# EAGLE design pad2 (EAGLE 6.5.0)
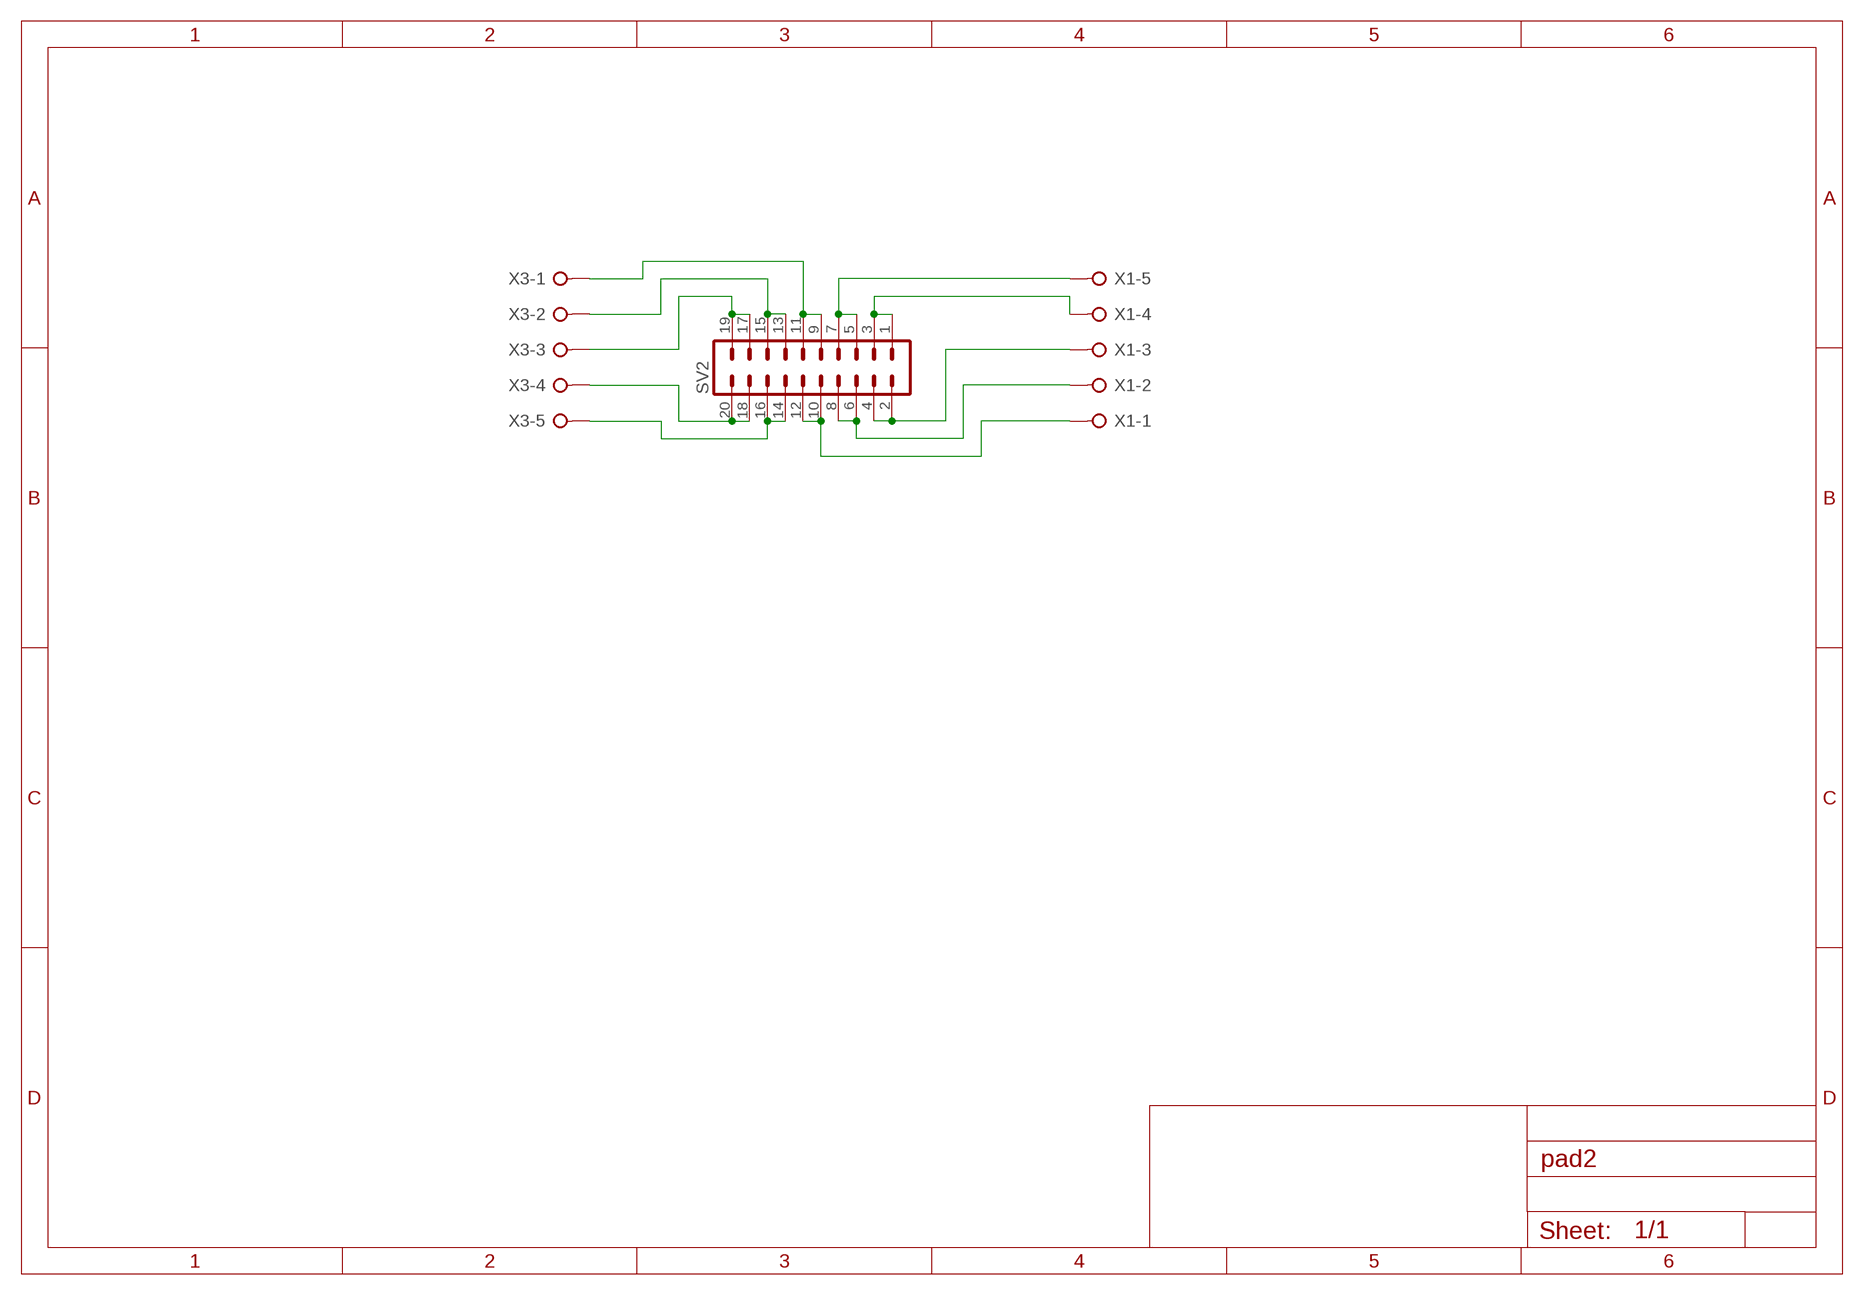
[diagram p0: schematic, sheet 1]

## Parts
SV2  MA10-2  [MA10-2]
X1  W237-05P  [W237-5P]
X3  W237-05P  [W237-5P]

## Nets
IN1: SV2.13 SV2.15 X3.2
IN2: SV2.17 SV2.19 X3.3
IN3: SV2.18 SV2.20 X3.4
IN4: SV2.14 SV2.16 X3.5
N$1: SV2.9 SV2.11 X3.1
N$2: SV2.10 SV2.12 X1.1
OUT1: SV2.6 SV2.8 X1.2
OUT2: SV2.2 SV2.4 X1.3
OUT3: SV2.1 SV2.3 X1.4
OUT4: SV2.5 SV2.7 X1.5

## Library data of the parts
SV2 = con-lstb:MA10-2: PIN HEADER; OC_FARNELL: unknown; OC_NEWARK: unknown
X1 X3 = con-wago-508:W237-05P: WAGO SREW CLAMP; OC_FARNELL: unknown; OC_NEWARK: unknown

## Board
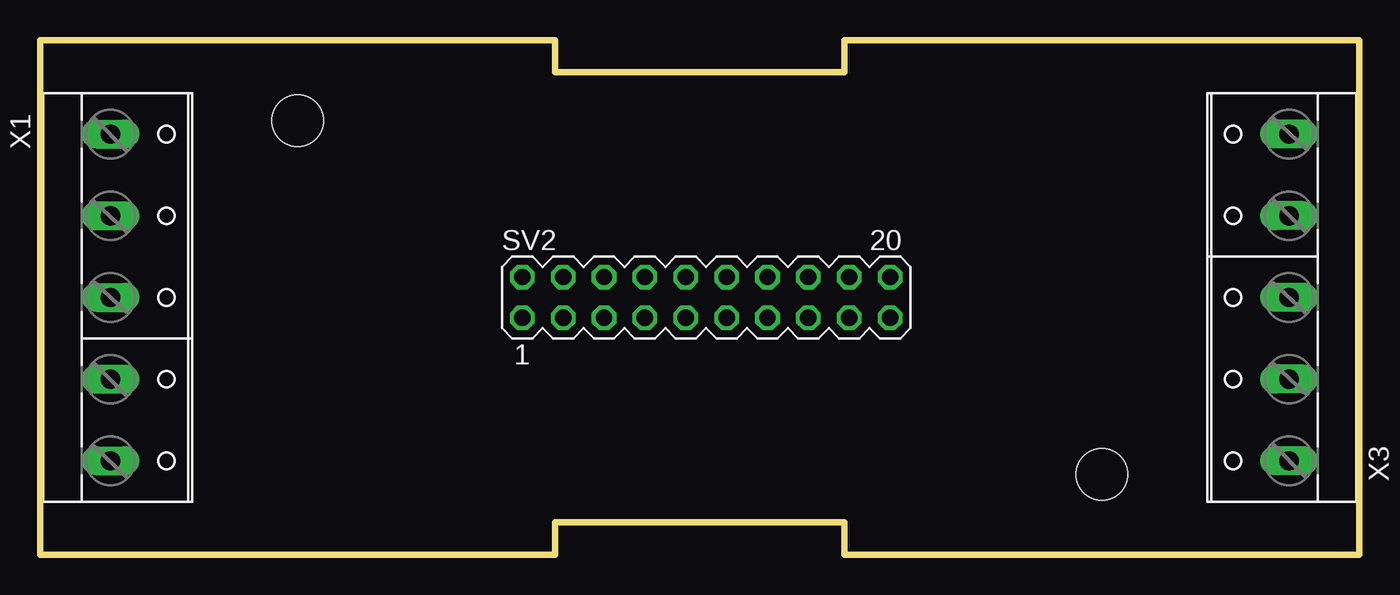
[diagram p1: board, top side]
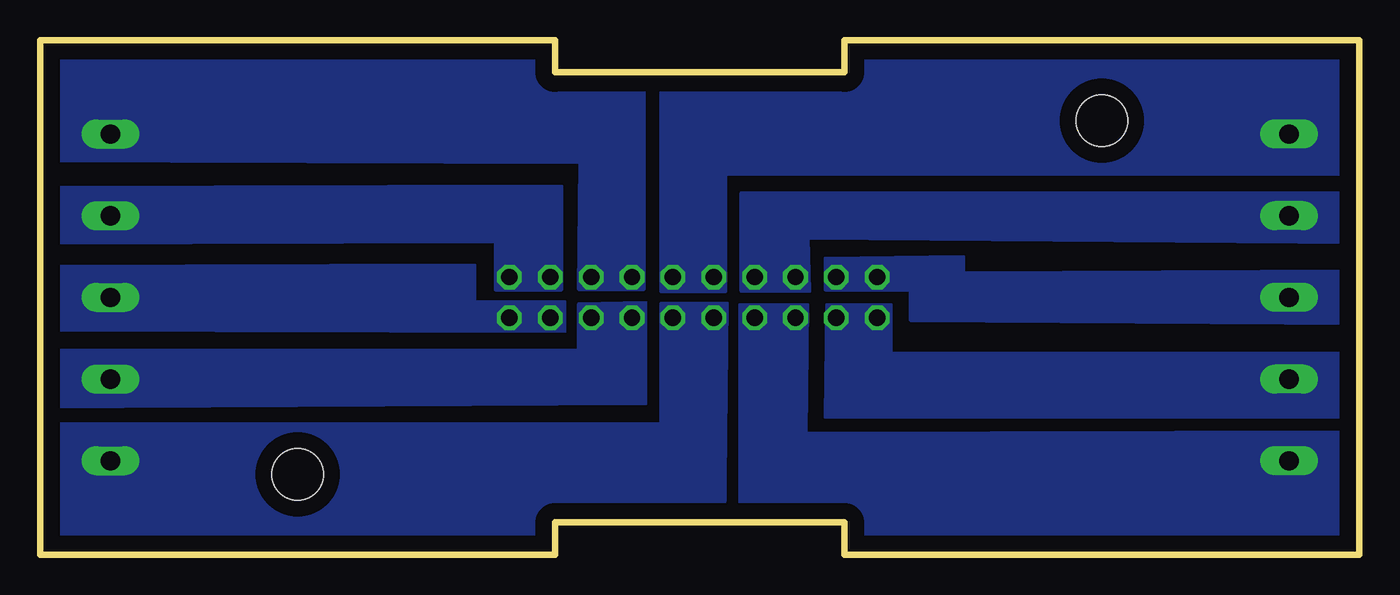
[diagram p2: board, bottom side, seen from below]

Size 82 x 32 mm. Coordinates in mm from the lower left corner, seen from the top.
Outline: 0,32 32,32 32,30 50,30 50,32 82,32 82,0 50,0 50,2 32,2 32,0 0,0 0,32
Copper layers (1*16): Top 0.035mm / dielectric 1.5mm / Bottom 0.035mm
Design rules "default": minimum track width 10mil, minimum drill 24mil, track to track 8mil, track to pad 8mil, pad to pad 8mil, via to via 8mil, smd to smd 8mil, copper to edge 40mil, drill to drill 8mil, minimum pad ring 10mil, minimum via ring 8mil, stop-mask expansion 4mil, vias tented up to drill 0mil, thermal gap 10mil
Holes 3.2 mm at 16,27 66,5

### Footprints (pad centres in the part's own frame; a part is rotated, then mirrored left to right if it is on the bottom)
MA10-2 = drill 1.016 octagon: 1 -11.43,-1.27; 2 -11.43,1.27; 3 -8.89,-1.27; 4 -8.89,1.27; 5 -6.35,-1.27; 6 -6.35,1.27; 7 -3.81,-1.27; 8 -3.81,1.27; 9 -1.27,-1.27; 10 -1.27,1.27; 11 1.27,-1.27; 12 1.27,1.27; 13 3.81,-1.27; 14 3.81,1.27; 15 6.35,-1.27; 16 6.35,1.27; 17 8.89,-1.27; 18 8.89,1.27; 19 11.43,-1.27; 20 11.43,1.27
W237-5P = drill 1.194 long: 1 -10.16,-0.635; 2 -5.08,-0.635; 3 0,-0.635; 4 5.08,-0.635; 5 10.16,-0.635

### Placement (x,y rotation side)
SV2  41.4,16 0 top
X1  5,16 270 top
X3  77,16 90 top

### Tracks (layer width: path | path; a pad name or v marks a point on that pad's centre or on a via)
IN1
  pour Bottom (no thermals): 44.4,15.7 44.4,9.4 82.2,9.2 82.1,12.7 48.5,12.7 48.5,15.6
IN2
  pour Bottom (no thermals): 49.4,13.9 49.4,15.7 55,15.7 55,18 82,17.9 82,14
IN3
  pour Bottom (no thermals): 49.6,22.9 82,22.8 82,19.4 53.7,19.5 53.7,16.5 49.6,16.5
IN4
  pour Bottom (no thermals): 44.5,31.9 44.5,16.5 48.5,16.5 48.4,24.4 82.4,24.5 82.3,32.1 82.2,32.2 45,32.2
N$1
  pour Bottom (no thermals): 39.3,15.6 43.4,15.6 43.4,8.1 82.1,8.1 82.1,-0.8 39.5,-0.8
N$2
  pour Bottom (no thermals): 0,32 43.4,32 43.4,16.4 39.4,16.4 39.4,23.7 0,23.7
OUT1
  pour Bottom (no thermals): 0.1,22.5 0,19.4 34.3,19.7 34.2,16.4 38.4,16.4 38.4,22.5
OUT2
  pour Bottom (no thermals): 0,17.6 24.6,17.5 24.6,18.5 33.2,18.4 33.2,16.5 27.9,16.5 27.9,14.6 0,14.4
OUT3
  pour Bottom (no thermals): 0.1,12.5 29.1,12.5 29.1,15.5 33.1,15.5 33.2,8.6 0.1,8.6
OUT4
  pour Bottom (no thermals): 0,7.6 34.4,7.5 34.3,15.5 38.5,15.5 38.5,-0.1 0,0